# Altium schematic sheet 1_uC.SchDoc
size A4; SheetNumber: 1; SheetTotal: 3
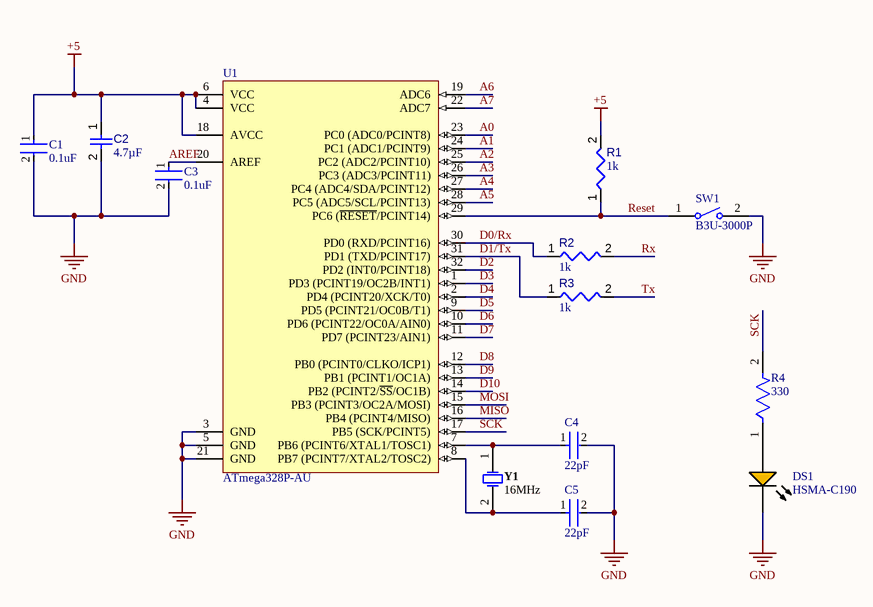
[diagram p0: 1_uC.SchDoc]

## Parts
C1  0.1uF  [FP-C0805C-DN-MFG]
C2  value 4.7µF  [CAPC0805(2012)145_L]  (hidden comment: Capacitor 4.7µF +/-40% 25V 0805)
C3  0.1uF  [FP-C0805C-DN-MFG]
C4  22pF  [FP-C0805C-DN-MFG]
C5  22pF  [FP-C0805C-DN-MFG]
DS1  HSMA-C190  [AVAG-HSMX-C190_V]
R1  value 1k  [RESC0805(2012)_L]  (hidden comment: 1KR5J)
R2  value 1k  [RESC0805(2012)_L]  (hidden comment: 1KR5J)
R3  value 1k  [RESC0805(2012)_L]  (hidden comment: 1KR5J)
R4  330  [FP-CRCW0805-e3-MFG]
SW1  B3U-3000P  [OMRON-B3U-3000P_V]
U1  ATmega328P-AU  [32A_M]
Y1  16MHz  [JPY-X053201602002_V]

## Nets
+5: C1.1 C2.1 R1.2 U1.4(VCC) U1.6(VCC) U1.18(AVCC)
GND: C1.2 C2.2 C3.2 C4.2 C5.2 DS1.2(K) SW1.2 U1.3(GND) U1.5(GND) U1.21(GND)
A0: U1.23(PC0_(ADC0/PCINT8))
A1: U1.24(PC1_(ADC1/PCINT9))
A2: U1.25(PC2_(ADC2/PCINT10))
A3: U1.26(PC3_(ADC3/PCINT11))
A4: U1.27(PC4_(ADC4/SDA/PCINT12))
A5: U1.28(PC5_(ADC5/SCL/PCINT13))
A6: U1.19(ADC6)
A7: U1.22(ADC7)
AREF: C3.1 U1.20(AREF)
D0/Rx: R2.1 U1.30(PD0_(RXD/PCINT16))
D1/Tx: R3.1 U1.31(PD1_(TXD/PCINT17))
D2: U1.32(PD2_(INT0/PCINT18))
D3: U1.1(PD3_(PCINT19/OC2B/INT1))
D4: U1.2(PD4_(PCINT20/XCK/T0))
D5: U1.9(PD5_(PCINT21/OC0B/T1))
D6: U1.10(PD6_(PCINT22/OC0A/AIN0))
D7: U1.11(PD7_(PCINT23/AIN1))
D8: U1.12(PB0_(PCINT0/CLKO/ICP1))
D9: U1.13(PB1_(PCINT1/OC1A))
D10: U1.14(PB2_(PCINT2/~{SS}/OC1B))
MISO: U1.16(PB4_(PCINT4/MISO))
MOSI: U1.15(PB3_(PCINT3/OC2A/MOSI))
Reset: R1.1 SW1.1 U1.29(PC6_(~{RESET}/PCINT14))
Rx: R2.2
SCK: R4.2 U1.17(PB5_(SCK/PCINT5))
Tx: R3.2
NetC4_1: C4.1 U1.7(PB6_(PCINT6/XTAL1/TOSC1)) Y1.1
NetC5_1: C5.1 U1.8(PB7_(PCINT7/XTAL2/TOSC2)) Y1.2
NetDS1_1: DS1.1(A) R4.1

## Library data of the parts
C1 C3 = CMP-03020-002581-2: C0805 0.10 μF X7R 30ppm/°C 20.00% 50 V; Manufacturer Part Number: C0805C104M5RAC; Manufacturer: KEMET; Capacitance: 0.10 μF; Voltage Rating: 50 V; Value: 0.10 μF; Tolerance: 0.2; Material: Ceramic; Category: Cap; Temperature: -55°C to +125°C; Lead Free: Yes; Device Class L3: Ceramic Capacitors; Package: C0805C-DN; Height: 0.88mm; Temperature Range High: +125°C; Device Class L2: Capacitors; Device Class L1: Passive Components; Temperature Coefficient: 30ppm/°C; ComponentLink2Description: Datasheet; RoHS: TRUE; Temperature Range Low: -55°C; ComponentLink2URL: https://content.kemet.com/datasheets/KEM_C1003_C0G_SMD.pdf; Temperature Characteristic: X7R; Mouser Description: Multilayer Ceramic Capacitors MLCC - SMD/SMT 50volts 0.1uF 20% X7R; Octopart: https://octopart.com/c0805c104m5rac-kemet-2226142; Ipc Land Pattern Name: CAPC200125X78; Automotive: No
C2 = CMP-001-00080-4: Chip Capacitor, 4.7µF +/-40%, 25V, 0805, Thickness 1.45 mm; Tolerance: 20%; Voltage Rating: 25V; Min Operating Temperature: -55°C; Max Operating Temperature: 85°C; Pins: 2; Mounting Technology: SMT; Case/Package: 0805
C4 C5 = CMP-03020-014766-1: C0805 22 pF X8R 30ppm/°C 5.00% 50 V; Manufacturer: KEMET; Manufacturer Part Number: C0805C220J5HACTU; Tolerance: 0.05; Voltage Rating: 50 V; Material: Ceramic; Ipc Land Pattern Name: CAPC200125X78; Value: 22 pF; ComponentLink2URL: https://content.kemet.com/datasheets/KEM_C1003_C0G_SMD.pdf; Device Class L1: Passive Components; Package: C0805C-DN; Temperature: -55°C to +125°C; Octopart: https://octopart.com/c0805c220j5hactu-kemet-88697040; Category: Cap; Device Class L3: Ceramic Capacitors; Temperature Range Low: -55°C; ComponentLink2Description: Datasheet; Height: 0.88mm; Device Class L2: Capacitors; Capacitance: 22 pF; Temperature Range High: +125°C; RoHS: TRUE; Automotive: No; Lead Free: Yes; Temperature Coefficient: 30ppm/°C; Temperature Characteristic: X8R
DS1 = CMP-007-00011-2: LED Uni-Color Amber, 60 mW, 20 mA, -40 to 85 degC, 2-Pin SMD, RoHS, Tape and Reel; Manufacturer: Avago; Forward Current: 20mA; Colour: Orange; Luminous Intensity: 90mcd; Lens Style: Diffused; Power: 60mW; Nominal Vf: 1.9V; Viewing Angle: 170degrees; Datasheet Version: Sep-10; Mounting Technology: SM; Case/Package: 0603; RoHS Compliant: True; Pins: 2; Packaging: TapeandReel; Package Reference: HSMX-C190; Manufacturer URL: http://www.avagotech.com/; Package Quantity: 4000; Min Operating Temperature: -40°C; Datasheet URL: http://docs.avagotech.com/docs/AV02-0112EN; Max Operating Temperature: 85°C; Forward Voltage: 1.9V; Package Description: 2-Pin Surface Mount Device, Body 1.6 x 0.8 mm, Height 0.9 mm; Illumination Colour: Orange
R1-R3 = CMP-009-00076-2: 1K 0.125W 5% 0805 (2012 Metric)  SMD; Power: 125mW; Pins: 2; Mounting Technology: SMT; Tolerance: 5%; Case/Package: 0805
R4 = CMP-2001-03823-2: RES Thick Film, 330Ω, 1%, 0.125W, 100ppm/°C, 0805; Voltage Rating (DC): 150V; Resistance: 330R; Max Power Dissipation: 125mW; Mount: Surface Mount; Packaging: Tape and Reel; Min Operating Temperature: -55°C; Military Standard: Not; Case Code (Metric): 2012; Height: 0.02inch; Voltage Rating: 150V; Case/Package: 0805; Max Operating Temperature: 155°C; Width: 0.049inch; Case Code (Imperial): 0805; Termination: SMD/SMT; Lead Free: Lead Free; Contact Plating: Tin; Package Quantity: 10; Composition: Thick Film; Length: 2mm; Features: Automotive AEC-Q200; Depth: 1.25mm; Weight: 0.000194oz; Tolerance: 1%; Power Rating: 125mW; Number of Terminations: 2; Temperature Coefficient: 100ppm/°C
SW1 = CMP-011-00005-2: Tactile Switch, SPST-NO, 0.05 A, 12 V, -25 to 70 degC, 2-Pin SMD, RoHS, Tape and Reel; Manufacturer: Omron Electronic Components; Operating Force: 162gf; Voltage Rating (DC): 12V; Current Rating: 50mA; IP Rating: IP40; Throw Configuration: SPST; Max Contact Resistance: 100mohm; RoHS Compliant: True; Contact Current Rating: 50mA; Manufacturer URL: http://www.omron.com/; Packaging: TapeandReel; Max Voltage Rating (DC): 12V; Contact Material: Silver; Datasheet Version: Jan-15; Package Reference: B3U-3000P; Package Description: 2-Pin Surface Mount Device, Body 4 x 3.2 mm; Min Operating Temperature: -25°C; Package Quantity: 4000; Max Operating Temperature: 70°C; Max Current Rating: 50mA; Voltage Rating: 12V; Case/Package: B3U-3000P; Mounting Technology: SM; Datasheet URL: https://www.omron.com/ecb/products/pdf/en-b3u.pdf
U1 = CMP-0095-00269-2: 8-bit AVR Microcontroller, 32KB Flash, 1KB EEPROM, 2KB SRAM, 32-pin TQFP, Industrial Grade (-40°C to 85°C); PackageDescription: 32-Lead, 7x7x1.0 mm Body, 0.8mm Lead Pitch, Thin Profile Plastic Quad Flat Package (TQFP); DatasheetVersion: revD, May-2011; RevisionNote: DatasheetVersion & PackageVersion updated. URLs added.; ComponentLink1URL: http://www.atmel.com/; ComponentLink2Description: ATmega48A/48PA/88A/88PA/168A/168PA/328/328P Datasheet; Code_JEDEC: MS-026-ABA; ComponentLink1Description: Manufacturer URL; PackageReference: 32A; ComponentLink3Description: ATmega48A/48PA/88A/88PA/168A/168PA/328/328P Summary; ComponentLink2URL: http://www.atmel.com/dyn/resources/prod_documents/doc8271.pdf; PackageVersion: revC, Oct-2010; ComponentLink3URL: http://www.atmel.com/dyn/resources/prod_documents/8271S.pdf
Y1 = CMP-003-00006-2: SMD Crystal, 16 MHz, +/- 20 ppm, 8 pF, -20 to 70 degC, 2-Pin SMD; Manufacturer: Shenzhen Jingpengyuan; Datasheet URL: http://datasheet.octopart.com/X053201602002-Jingpengyuan-datasheet-62330935.pdf; Frequency: 16MHz; RoHS Compliant: Unknown; Case/Package: X053201602002; Manufacturer URL: http://www.chjiahui.com/; Datasheet Version: May-13; Package Reference: X053201602002; Package Description: 2-Pin Surface Mount Device, Body 5 x 3.2 mm; Mounting Technology: SM